# EAGLE board BlueBoard_v1 (EAGLE 6.2), part 1 of 3
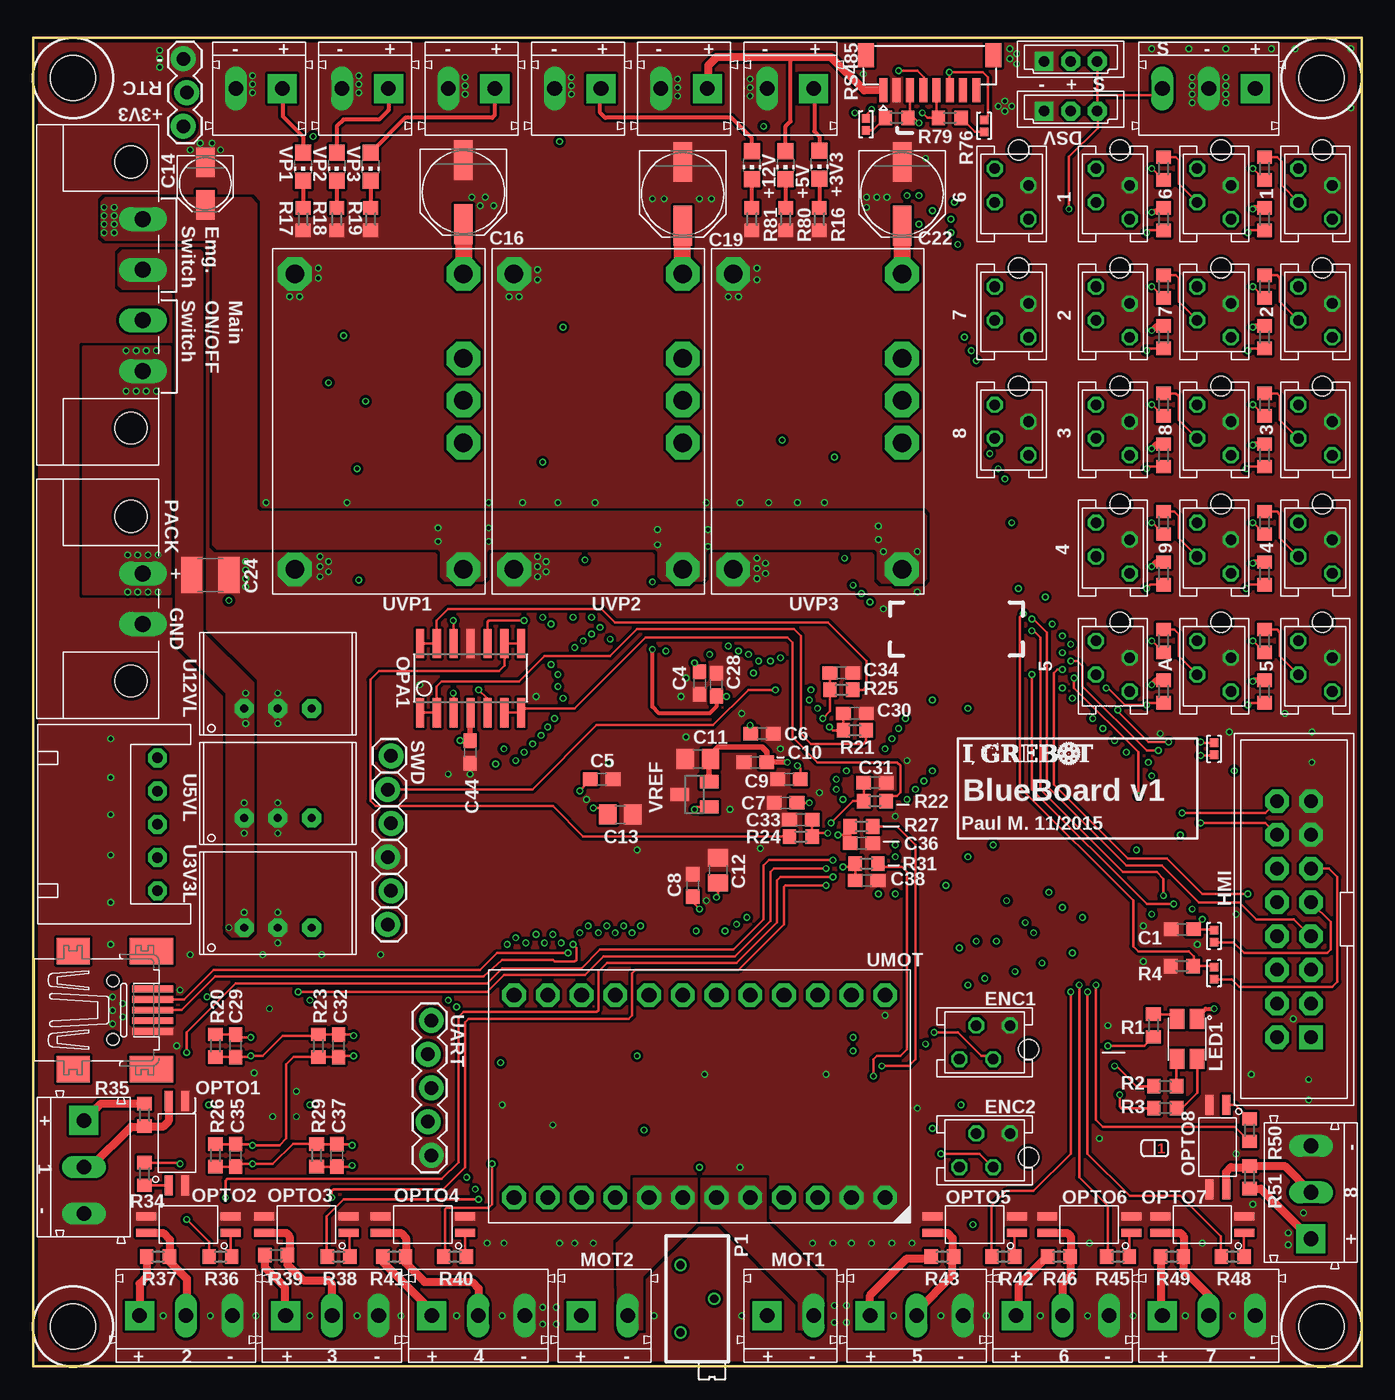
[diagram p6: board, top side]
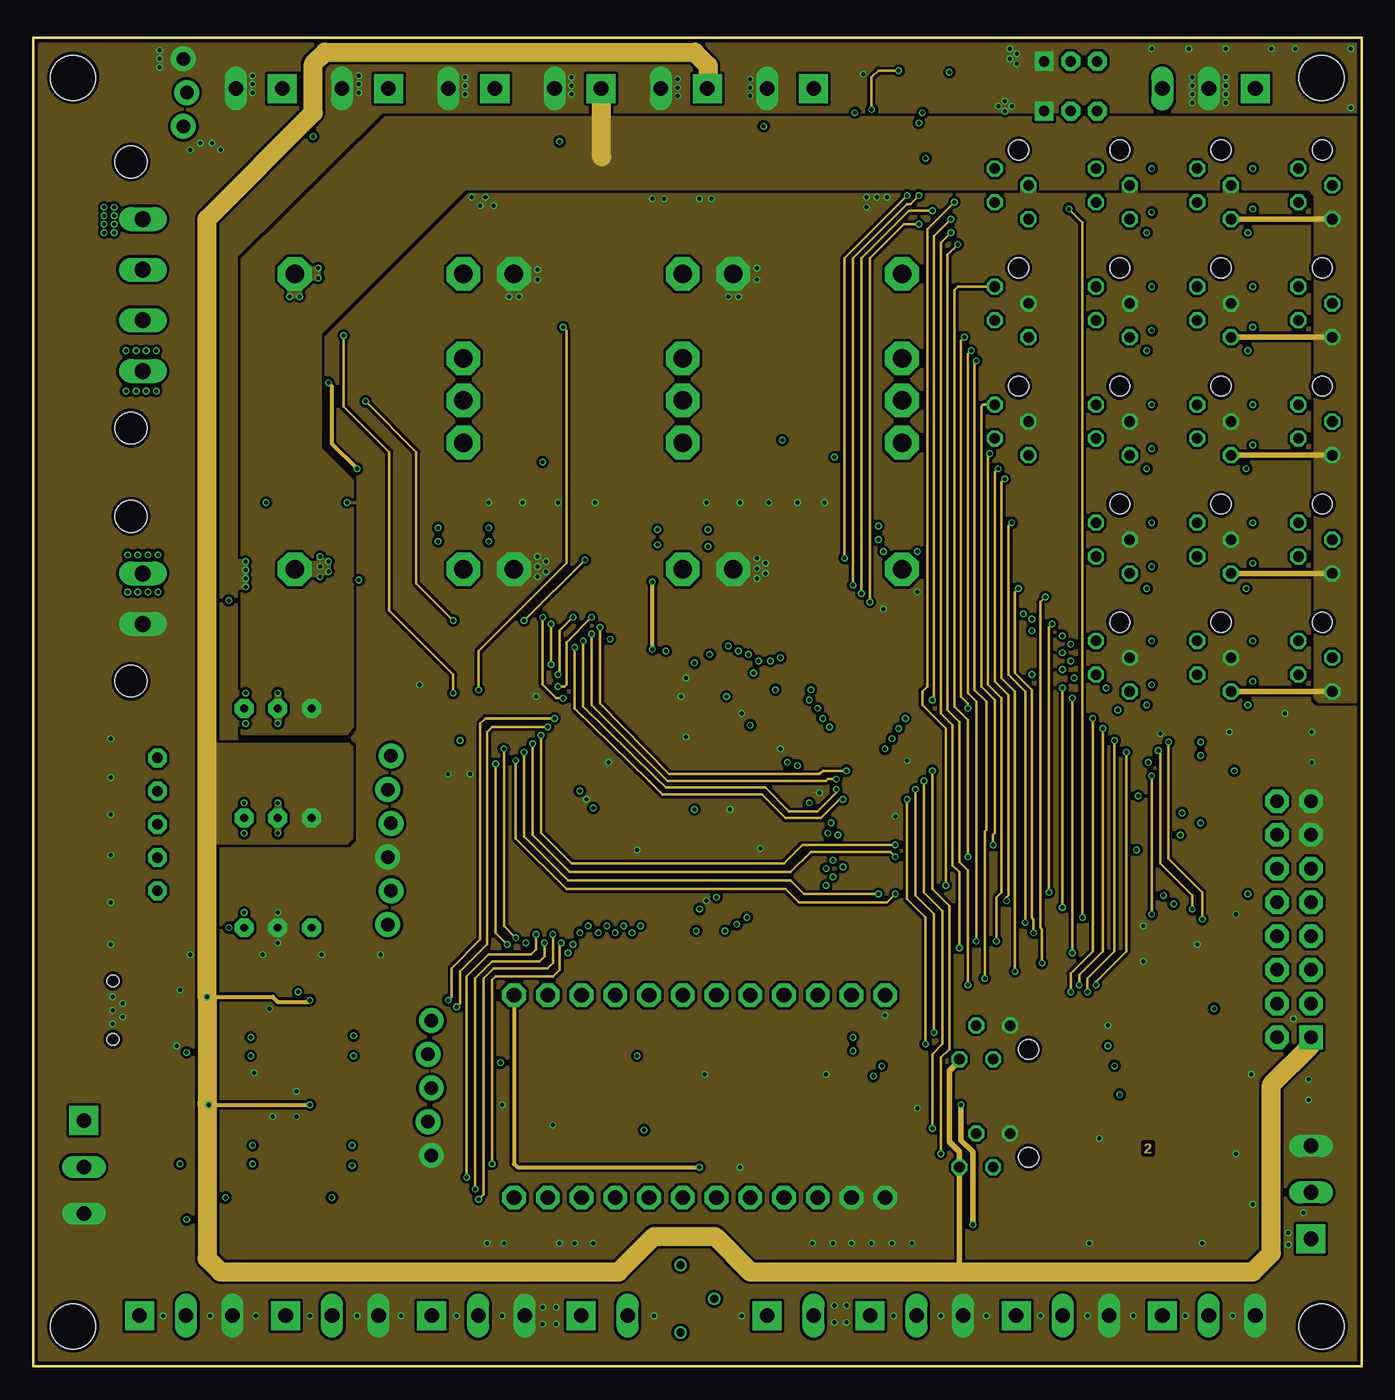
[diagram p7: board, inner layer Route2]
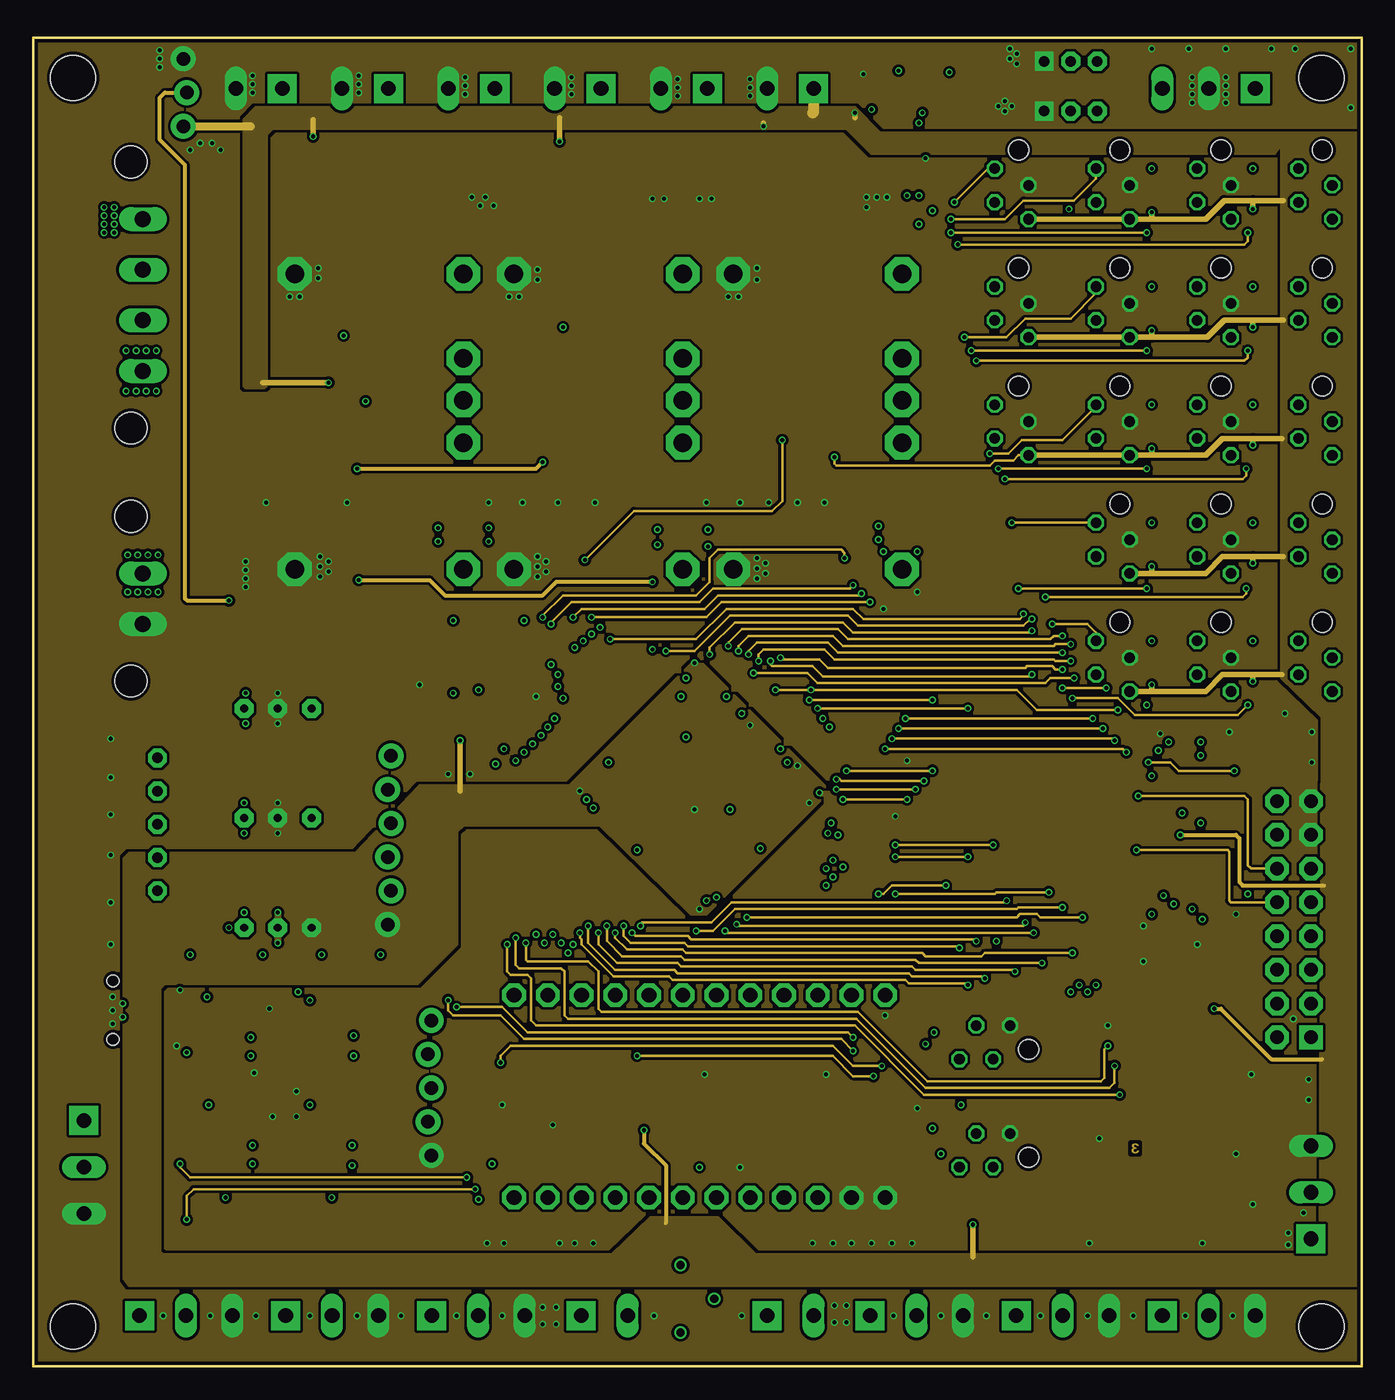
[diagram p8: board, inner layer Route15]
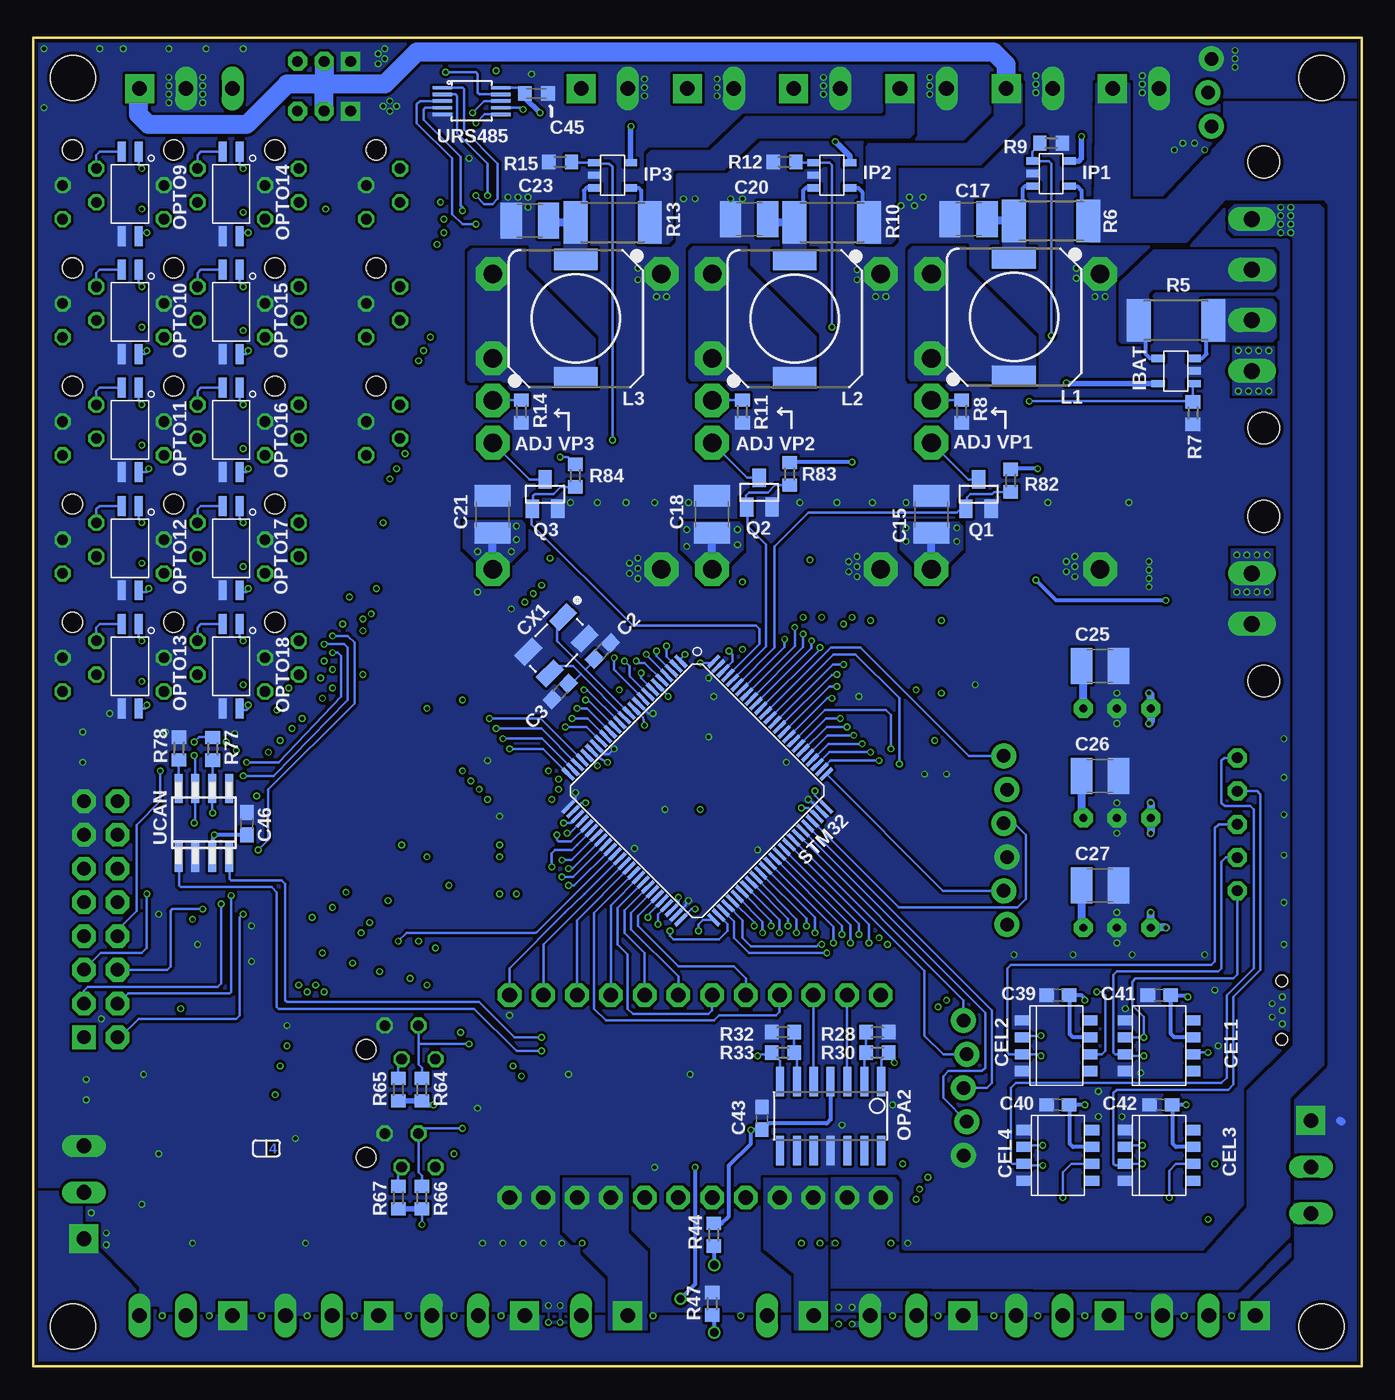
[diagram p9: board, bottom side, seen from below]

Size 100 x 100 mm. Coordinates in mm from the lower left corner, seen from the top.
Outline: 0,0 100,0 100,100 0,100 0,0
Copper layers (1*2*15*16): Top 0.035mm / dielectric 0.2mm / Route2 0.0175mm / dielectric 0.3mm / Route15 0.0175mm / dielectric 0.2mm / Bottom 0.035mm
Design rules: minimum track width 8mil, minimum drill 12mil, track to track 8mil, track to pad 8mil, pad to pad 8mil, via to via 8mil, smd to smd 0mil, copper to edge 10mil, drill to drill 8mil, minimum pad ring 6mil, minimum via ring 4mil, stop-mask expansion 4mil, vias tented up to drill 100mil, thermal gap 10mil
Holes 3.4 mm at 3,97 97,97 97,3 3,3

## Footprints (pad centres in the part's own frame; a part is rotated, then mirrored left to right if it is on the bottom)
CON_3.5_3 = drill 1.1 pad 2.184 square: 1 -3.5,0 | drill 1.1 long: 2 0,0; 3 3.5,0
CON_3.81_LR_2 = drill 1.2 long: 1 -1.905,0; 2 1.905,0 | hole 2.4: -6.205,-0.9; 6.205,-0.9
JST-XH-5S = drill 0.8 pad 1.422 octagon: 1 -5,0; 2 -2.5,0; 3 0,0; 4 2.5,0; 5 5,0
C0603 = smd 1.1 x 1: 1 -0.85,0; 2 0.85,0
C0805 = smd 1.3 x 1.5: 1 -0.95,0; 2 0.95,0
PANASONIC_B = smd 2.2 x 1.4: + 1.6,0; - -1.6,0
C3225 = smd 1.6 x 2.7: 1 -1.4,0; 2 1.4,0
PANASONIC_D = smd 3 x 1.4: + 2.4,0; - -2.4,0
C1210 = smd 1.6 x 2.7: 1 -1.4,0; 2 1.4,0
C0603K = smd 1.05 x 1.08: 1 -0.875,0; 2 0.875,0
S8 = smd 0.762 x 1.143: 1 -1.905,-2.54; 2 -0.635,-2.54; 3 0.635,-2.54; 4 1.905,-2.54; 5 1.905,2.54; 6 0.635,2.54; 7 -0.635,2.54; 8 -1.905,2.54
CRYSTAL-OSC-SMD-5X3 = smd 1.9 x 1.1: 1 -1.85,-1.15; 2 1.85,-1.15; 3 1.85,1.15; 4 -1.85,1.15
CON_2.00_MOLEX-53253_3 = drill 0.8 pad 1.422 square: 1 -2,0 | drill 0.8 pad 1.422 octagon: 2 0,0; 3 2,0
CON_1.27_4 = drill 0.8 octagon: 1 -1.905,-1.27; 2 -0.635,1.27; 3 0.635,-1.27; 4 1.905,1.27 | hole 1.5: 3.305,-0.53
CON_2X_2.54_V_16 = drill 1.02 pad 1.778 square: 1 8.89,1.27 | drill 1.02 pad 1.778 octagon: 2 8.89,-1.27; 3 6.35,1.27; 4 6.35,-1.27; 5 3.81,1.27; 6 3.81,-1.27; 7 1.27,1.27; 8 1.27,-1.27; 9 -1.27,1.27; 10 -1.27,-1.27; 11 -3.81,1.27; 12 -3.81,-1.27; 13 -6.35,1.27; 14 -6.35,-1.27; 15 -8.89,1.27; 16 -8.89,-1.27
DBV_05 = smd 0.55 x 1: 1 -0.95,-1.35; 2 0,-1.35; 3 0.95,-1.35; 4 0.95,1.35; 5 -0.95,1.35
DR1030 = smd 3.3 x 1.6: 1 0,4.45; 2 0,-4.45
PLCC4 = smd 1.1 x 1.5: 1 -0.75,-1.5; 2 -0.75,1.5; 3 0.75,1.5; 4 0.75,-1.5
CHIP-LED0805 = smd 1.2 x 1.2: A 0,-1.05; C 0,1.05
CON_3.5_2 = drill 1.1 pad 2.184 square: 1 -1.75,0 | drill 1.1 long: 2 1.75,0
SO14 = smd 0.61 x 2.21: 1 -3.81,-2.603; 2 -2.54,-2.603; 3 -1.27,-2.603; 4 0,-2.603; 5 1.27,-2.603; 6 2.54,-2.603; 7 3.81,-2.603; 8 3.81,2.603; 9 2.54,2.603; 10 1.27,2.603; 11 0,2.603; 12 -1.27,2.603; 13 -2.54,2.603; 14 -3.81,2.603
SSOP_4 = smd 1.5 x 0.6: 1 -3.175,0.635; 2 -3.175,-0.635; 3 3.175,-0.635; 4 3.175,0.635
RTRIMT93XB = drill 0.61: 1 1.27,-2.54; 2 -1.27,0; 3 1.27,2.54
SOT23 = smd 1 x 1.4: 1 -0.95,-1.1; 2 0.95,-1.1; 3 0,1.1
R0603 = smd 1 x 1.1: 1 -0.85,0; 2 0.85,0
R2512 = smd 1.8 x 3.2: 1 -2.8,0; 2 2.8,0
JST-SHR-08V = smd 0.6 x 1.8: 1 -3.5,-3.55; 2 -2.5,-3.55; 3 -1.5,-3.55; 4 -0.5,-3.55; 5 0.5,-3.55; 6 1.5,-3.55; 7 2.5,-3.55; 8 3.5,-3.55 | smd 1.2 x 1.8: M1 -4.8,-0.9; M2 4.8,-0.9
1X03_LOCK = drill 1.016 pad 1.88: 1 0,0.127; 2 2.54,-0.127; 3 5.08,0.127
SJ_2S-NOTRACE = smd 0.635 x 0.635: 1 -0.457,0; 2 0.457,0
LQFP_100 = smd 0.28 x 1.2: 1 -6,-7.75; 2 -5.5,-7.75; 3 -5,-7.75; 4 -4.5,-7.75; 5 -4,-7.75; 6 -3.5,-7.75; 7 -3,-7.75; 8 -2.5,-7.75; 9 -2,-7.75; 10 -1.5,-7.75; 11 -1,-7.75; 12 -0.5,-7.75; 13 0,-7.75; 14 0.5,-7.75; 15 1,-7.75; 16 1.5,-7.75; 17 2,-7.75; 18 2.5,-7.75; 19 3,-7.75; 20 3.5,-7.75; 21 4,-7.75; 22 4.5,-7.75; 23 5,-7.75; 24 5.5,-7.75; 25 6,-7.75; 51 6,7.75; 52 5.5,7.75; 53 5,7.75; 54 4.5,7.75; 55 4,7.75; 56 3.5,7.75; 57 3,7.75; 58 2.5,7.75; 59 2,7.75; 60 1.5,7.75; 61 1,7.75; 62 0.5,7.75; 63 0,7.75; 64 -0.5,7.75; 65 -1,7.75; 66 -1.5,7.75; 67 -2,7.75; 68 -2.5,7.75; 69 -3,7.75; 70 -3.5,7.75; 71 -4,7.75; 72 -4.5,7.75; 73 -5,7.75; 74 -5.5,7.75; 75 -6,7.75 | smd 1.2 x 0.28: 26 7.75,-6; 27 7.75,-5.5; 28 7.75,-5; 29 7.75,-4.5; 30 7.75,-4; 31 7.75,-3.5; 32 7.75,-3; 33 7.75,-2.5; 34 7.75,-2; 35 7.75,-1.5; 36 7.75,-1; 37 7.75,-0.5; 38 7.75,0; 39 7.75,0.5; 40 7.75,1; 41 7.75,1.5; 42 7.75,2; 43 7.75,2.5; 44 7.75,3; 45 7.75,3.5; 46 7.75,4; 47 7.75,4.5; 48 7.75,5; 49 7.75,5.5; 50 7.75,6; 76 -7.75,6; 77 -7.75,5.5; 78 -7.75,5; 79 -7.75,4.5; 80 -7.75,4; 81 -7.75,3.5; 82 -7.75,3; 83 -7.75,2.5; 84 -7.75,2; 85 -7.75,1.5; 86 -7.75,1; 87 -7.75,0.5; 88 -7.75,0; 89 -7.75,-0.5; 90 -7.75,-1; 91 -7.75,-1.5; 92 -7.75,-2; 93 -7.75,-2.5; 94 -7.75,-3; 95 -7.75,-3.5; 96 -7.75,-4; 97 -7.75,-4.5; 98 -7.75,-5; 99 -7.75,-5.5; 100 -7.75,-6
1X06_LOCK = drill 1.016 pad 1.88: 1 0,0; 2 2.54,-0.254; 3 5.08,0; 4 7.62,-0.254; 5 10.16,0; 6 12.7,-0.254
CON_3.81_LR_4 = drill 1.2 long: 1 -5.715,0; 2 -1.905,0; 3 1.905,0; 4 5.715,0 | hole 2.4: -10.015,-0.9; 10.015,-0.9
TSR1 = drill 0.6 pad 1.422 octagon: 1 -2.54,0; 2 0,0; 3 2.54,0
1X05_LOCK = drill 1.016 pad 1.88: 1 0,0.127; 2 2.54,-0.127; 3 5.08,0.127; 4 7.62,-0.127; 5 10.16,0.127
SO-08 = smd 0.6 x 2.2: 1 -1.905,-2.6; 2 -0.635,-2.6; 3 0.635,-2.6; 4 1.905,-2.6; 5 1.905,2.6; 6 0.635,2.6; 7 -0.635,2.6; 8 -1.905,2.6
MODULE_DRV884X_REV = drill 1.1 pad 1.778 octagon: 1 -13.97,17.145; 2 -11.43,17.145; 3 -8.89,17.145; 4 -6.35,17.145; 5 -3.81,17.145; 6 -1.27,17.145; 7 1.27,17.145; 8 3.81,17.145; 9 6.35,17.145; 10 8.89,17.145; 11 11.43,17.145; 12 13.97,17.145; 13 1.27,1.905; 14 3.81,1.905; 15 6.35,1.905; 16 8.89,1.905; 17 11.43,1.905; 18 13.97,1.905; 19 -1.27,1.905; 20 -3.81,1.905; 21 -6.35,1.905; 22 -8.89,1.905; 23 -11.43,1.905; 24 -13.97,1.905
MSOP-10 = smd 0.25 x 1.45: 1 -1,-2.2; 2 -0.5,-2.2; 3 0,-2.2; 4 0.5,-2.2; 5 1,-2.2; 6 1,2.2; 7 0.5,2.2; 8 0,2.2; 9 -0.5,2.2; 10 -1,2.2
32005-201 = smd 3.1 x 0.5: 1 3,1.6; 2 3,0.8; 3 3,0; 4 3,-0.8; 5 3,-1.6 | smd 2.5 x 2: M1 -3,-4.45; M2 -3,4.45 | smd 3.3 x 2: M3 2.9,4.45; M4 2.9,-4.45 | hole 0.9: 0,2.2; 0,-2.2
PTN78060 = drill 1.4 pad 2.54 octagon: 1 -11.113,6.35; 2 -11.113,-6.35; 3 -1.587,-6.35; 4 1.587,-6.35; 5 4.763,-6.35; 6 11.113,-6.35; 7 11.113,6.35

## Placement (x,y rotation side)
ASV1  CON_3.5_3  [CON_3.5_3]  3.81,15 270 top
ASV2  CON_3.5_3  [CON_3.5_3]  11.5,3.81 0 top
ASV3  CON_3.5_3  [CON_3.5_3]  22.5,3.81 0 top
ASV4  CON_3.5_3  [CON_3.5_3]  33.5,3.81 0 top
ASV5  CON_3.5_3  [CON_3.5_3]  66.5,3.81 0 top
ASV6  CON_3.5_3  [CON_3.5_3]  77.5,3.81 0 top
ASV7  CON_3.5_3  [CON_3.5_3]  88.5,3.81 0 top
ASV8  CON_3.5_3  [CON_3.5_3]  96.19,13.1 90 top
BAT1  MC15-GF-3.81-LR_2  [CON_3.81_LR_2]  8.26,57.78 270 top
BAT2  JST-XH-S_5  [JST-XH-5S]  9.36,40.8 90 top
C1  100nF  [C0603]  86.5,32.9 180 top
C2  18 pF  [C0603]  57.15,53.85 45 bottom
C3  18 pF  [C0603]  60.33,50.8 225 bottom
C4  100nF  [C0603]  50.16,51.44 270 top
C5  100nF  [C0603]  42.8,44.2 0 top
C6  100nF  [C0603]  54.86,47.62 0 top
C7  100nF  [C0603]  56.64,42.42 180 top
C8  100nF  [C0603]  49.66,36.2 90 top
C9  10nF  [C0603]  56.9,44.2 180 top
C10  10nF  [C0603]  54.36,45.47 180 top
C11  1uF  [C0805]  50.04,45.72 180 top
C12  2.2uF  [C0805]  51.56,37.34 90 top
C13  2.2uF  [C0805]  44.2,41.53 0 top
C14  22uF  [PANASONIC_B]  12.95,89.03 270 top
C15  22uF  [C3225]  32.38,64.14 90 bottom
C16  220uF  [PANASONIC_D]  32.38,88.39 270 top
C17  2.2uF  [C3225]  29.59,86.36 180 bottom
C18  22uF  [C3225]  48.9,64.14 90 bottom
C19  220uF  [PANASONIC_D]  48.9,88.27 270 top
C20  2.2uF  [C3225]  46.1,86.36 180 bottom
C21  22uF  [C3225]  65.41,64.14 90 bottom
C22  220uF  [PANASONIC_D]  65.41,88.27 270 top
C23  2.2uF  [C3225]  62.61,86.23 180 bottom
C24  22uF  [C3225]  13.34,59.56 0 top
C25  22uF  [C1210]  19.68,52.7 0 bottom
C26  22uF  [C1210]  19.68,44.45 0 bottom
C27  22uF  [C1210]  19.68,36.2 0 bottom
C28  100nF  [C0603]  51.44,51.31 90 top
C29  100nF  [C0603]  15.24,24.13 270 top
C30  3.3nF  [C0603]  61.85,49.15 0 top
C31  3.3nF  [C0603]  63.37,43.94 0 top
C32  100nF  [C0603]  22.99,24.13 270 top
C33  3.3nF  [C0603]  57.78,41.15 180 top
C34  3.3nF  [C0603]  60.83,52.2 0 top
C35  100nF  [C0603]  15.24,15.88 270 top
C36  3.3nF  [C0603]  62.36,39.37 0 top
C37  100nF  [C0603]  22.86,15.88 270 top
C38  3.3nF  [C0603]  62.74,36.58 0 top
C39  220nF  [C0603]  22.86,27.94 180 bottom
C40  220nF  [C0603]  22.86,19.68 180 bottom
C41  220nF  [C0603]  15.24,27.94 180 bottom
C42  220nF  [C0603]  15.11,19.68 180 bottom
C43  100nF  [C0603]  45.13,18.66 90 bottom
C44  100nF  [C0603]  32.89,46.24 270 top
C45  100nF  [C0603K]  62.12,95.81 0 bottom
C46  100nF  [C0603]  83.9,40.85 90 bottom
CEL1  LT1990  [S8]  15.24,24.13 270 bottom
CEL2  LT1990  [S8]  22.99,24.13 270 bottom
CEL3  LT1990  [S8]  15.24,15.88 270 bottom
CEL4  LT1990  [S8]  22.86,15.88 270 bottom
CX1  XTAL_5X3  [CRYSTAL-OSC-SMD-5X3]  60.61,54.28 225 bottom
DSV1  CON_2.00_MOLEX-53253_3  [CON_2.00_MOLEX-53253_3]  78.1,98.24 0 top
DSV2  CON_2.00_MOLEX-53253_3  [CON_2.00_MOLEX-53253_3]  78.1,94.5 0 top
DSV3  CON_3.5_3  [CON_3.5_3]  88.5,96.19 180 top
ENC1  CON_1.27_4  [CON_1.27_4]  71.63,24.38 0 top
ENC2  CON_1.27_4  [CON_1.27_4]  71.63,16.26 0 top
END1  CON_1.27_4  [CON_1.27_4]  81.28,88.27 90 top
END2  CON_1.27_4  [CON_1.27_4]  81.28,79.38 90 top
END3  CON_1.27_4  [CON_1.27_4]  81.28,70.48 90 top
END4  CON_1.27_4  [CON_1.27_4]  81.28,61.59 90 top
END5  CON_1.27_4  [CON_1.27_4]  81.28,52.7 90 top
END6  CON_1.27_4  [CON_1.27_4]  73.66,88.27 90 top
END7  CON_1.27_4  [CON_1.27_4]  73.66,79.38 90 top
END8  CON_1.27_4  [CON_1.27_4]  73.66,70.48 90 top
HMI  HE10_V_16  [CON_2X_2.54_V_16]  94.92,33.66 270 top
IBAT  INA138  [DBV_05]  13.97,74.93 90 bottom
IND1  CON_1.27_4  [CON_1.27_4]  96.52,88.27 90 top
IND2  CON_1.27_4  [CON_1.27_4]  96.52,79.38 90 top
IND3  CON_1.27_4  [CON_1.27_4]  96.52,70.48 90 top
IND4  CON_1.27_4  [CON_1.27_4]  96.52,61.59 90 top
IND5  CON_1.27_4  [CON_1.27_4]  96.52,52.7 90 top
IND6  CON_1.27_4  [CON_1.27_4]  88.9,88.27 90 top
IND7  CON_1.27_4  [CON_1.27_4]  88.9,79.38 90 top
IND8  CON_1.27_4  [CON_1.27_4]  88.9,70.48 90 top
IND9  CON_1.27_4  [CON_1.27_4]  88.9,61.59 90 top
IND10  CON_1.27_4  [CON_1.27_4]  88.9,52.7 90 top
IP1  INA138  [DBV_05]  23.37,89.79 270 bottom
IP2  INA138  [DBV_05]  39.88,89.66 270 bottom
IP3  INA138  [DBV_05]  56.39,89.66 270 bottom
L1  2.8uH  [DR1030]  26.16,78.99 180 bottom
L2  2.8uH  [DR1030]  42.67,78.87 180 bottom
L3  2.8uH  [DR1030]  59.15,78.88 180 bottom
LED1  ASMB-MTB0-0A3A2  [PLCC4]  86.87,24.64 180 top
LED4  [CHIP-LED0805]  59.18,90.45 180 top
LED5  [CHIP-LED0805]  20.32,90.31 180 top
LED6  [CHIP-LED0805]  22.86,90.32 180 top
LED7  [CHIP-LED0805]  25.4,90.32 180 top
LED8  [CHIP-LED0805]  56.64,90.42 180 top
LED9  [CHIP-LED0805]  54.1,90.42 180 top
LOGO_IGREBOT  LOGO_IGREBOT12X2MM  [IGREBOT_12X2MM]  69.98,45.47 0 top
LOGO_LAYERS  LAYERS_CHECK4_LAYERS  [LAYERS_CHECK_4]  83.44,17.02 180 top
MOT1  CON_3.5_2  [CON_3.5_2]  57,3.81 0 top
MOT2  CON_3.5_2  [CON_3.5_2]  43,3.81 0 top
OPA1  OPA4340U  [SO14]  32.93,51.8 0 top
OPA2  OPA4340U  [SO14]  39.97,18.84 180 bottom
OPTO1  EL3H7-G  [SSOP_4]  10.82,16.79 90 top
OPTO2  EL3H7-G  [SSOP_4]  11.68,10.67 180 top
OPTO3  EL3H7-G  [SSOP_4]  20.57,10.67 180 top
OPTO4  EL3H7-G  [SSOP_4]  29.34,10.67 180 top
OPTO5  EL3H7-G  [SSOP_4]  70.87,10.67 180 top
OPTO6  EL3H7-G  [SSOP_4]  79.5,10.67 180 top
OPTO7  EL3H7-G  [SSOP_4]  88.01,10.67 180 top
OPTO8  EL3H7-G  [SSOP_4]  89.17,16.51 270 top
OPTO9  EL3H4-G  [SSOP_4]  92.71,88.27 270 bottom
OPTO10  EL3H4-G  [SSOP_4]  92.71,79.38 270 bottom
OPTO11  EL3H4-G  [SSOP_4]  92.71,70.48 270 bottom
OPTO12  EL3H4-G  [SSOP_4]  92.71,61.59 270 bottom
OPTO13  EL3H4-G  [SSOP_4]  92.71,52.7 270 bottom
OPTO14  EL3H4-G  [SSOP_4]  85.09,88.27 270 bottom
OPTO15  EL3H4-G  [SSOP_4]  85.09,79.38 270 bottom
OPTO16  EL3H4-G  [SSOP_4]  85.09,70.48 270 bottom
OPTO17  EL3H4-G  [SSOP_4]  85.09,61.59 270 bottom
OPTO18  EL3H4-G  [SSOP_4]  85.09,52.7 270 bottom
P1  50k  [RTRIMT93XB]  50,5.08 180 top
Q1  BSS138  [SOT23]  28.83,65.66 0 bottom
Q2  BSS138  [SOT23]  45.34,65.79 0 bottom
Q3  BSS138  [SOT23]  61.47,65.66 0 bottom
R1  270  [R0603]  84.33,25.65 90 top
R2  47  [R0603]  85.22,21.08 0 top
R3  47  [R0603]  85.22,19.43 0 top
R4  47k  [R0603]  86.47,30.12 0 top
R5  R005  [R2512]  13.97,78.74 180 bottom
R6  R01  [R2512]  23.37,86.23 0 bottom
R7  300k  [R0603]  12.7,71.75 90 bottom
R8  21k  [R0603]  30.1,71.88 90 bottom
R9  510k  [R0603]  23.37,92.08 180 bottom
R10  R01  [R2512]  39.88,86.11 0 bottom
R11  7.5k  [R0603]  46.61,71.88 90 bottom
R12  510k  [R0603]  43.43,90.68 0 bottom
R13  R01  [R2512]  56.39,86.11 0 bottom
R14  383k  [R0603]  63.25,71.88 90 bottom
R15  510k  [R0603]  60.33,90.68 0 bottom
R16  270  [R0603]  59.18,86.36 270 top
R17  680  [R0603]  20.32,86.36 270 top
R18  1k  [R0603]  22.86,86.36 270 top
R19  2k  [R0603]  25.4,86.36 270 top
R20  47k  [R0603]  13.72,24.13 90 top
R21  470  [R0603]  61.85,47.88 180 top
R22  470  [R0603]  63.37,42.55 180 top
R23  47k  [R0603]  21.46,24.13 90 top
R24  470  [R0603]  57.78,39.88 0 top
R25  470  [R0603]  60.83,50.93 180 top
R26  47k  [R0603]  13.72,15.88 90 top
R27  470  [R0603]  62.36,40.64 180 top
R28  10k  [R0603]  36.45,25.15 180 bottom
R29  47k  [R0603]  21.34,15.88 90 top
R30  33k  [R0603]  36.45,23.62 0 bottom
R31  470  [R0603]  62.74,37.85 180 top
R32  10k  [R0603]  43.56,25.15 0 bottom
R33  33k  [R0603]  43.56,23.62 180 bottom
R34  330  [R0603]  8.38,14.48 270 top
R35  330  [R0603]  8.38,18.92 90 top
R36  330  [R0603]  14.1,8.26 0 top
R37  330  [R0603]  9.4,8.26 180 top
R38  330  [R0603]  22.99,8.26 0 top
R39  330  [R0603]  18.29,8.38 180 top
R40  330  [R0603]  31.75,8.26 0 top
R41  330  [R0603]  27.18,8.26 180 top
R42  330  [R0603]  73.03,8.26 0 top
R43  330  [R0603]  68.45,8.26 180 top
R44  33k  [R0603]  48.77,9.91 90 bottom
R45  330  [R0603]  81.66,8.26 0 top
R46  330  [R0603]  77.22,8.26 180 top
R47  21k  [R0603]  48.9,4.7 270 bottom
R48  330  [R0603]  90.3,8.26 0 top
R49  330  [R0603]  85.72,8.26 180 top
R50  330  [R0603]  91.57,17.78 90 top
R51  330  [R0603]  91.57,14.22 270 top
R52  1k  [R0603]  92.71,90.17 270 top
R53  330  [R0603]  92.71,86.36 90 top
R54  1k  [R0603]  92.71,81.28 270 top
R55  330  [R0603]  92.71,77.47 90 top
R56  1k  [R0603]  92.71,72.39 270 top
R57  330  [R0603]  92.71,68.58 90 top
R58  1k  [R0603]  92.71,63.5 270 top
R59  330  [R0603]  92.71,59.69 90 top
R60  1k  [R0603]  92.71,54.61 270 top
R61  330  [R0603]  92.71,50.8 90 top
R62  1k  [R0603]  85.09,90.17 270 top
R63  330  [R0603]  85.09,86.36 90 top
R64  10k  [R0603]  70.74,20.83 270 bottom
R65  10k  [R0603]  72.52,20.83 270 bottom
R66  10k  [R0603]  70.74,12.7 270 bottom
R67  10k  [R0603]  72.52,12.7 270 bottom
R68  1k  [R0603]  85.09,81.28 270 top
R69  330  [R0603]  85.09,77.47 90 top
R70  1k  [R0603]  85.09,72.39 270 top
R71  330  [R0603]  85.09,68.58 90 top
R72  1k  [R0603]  85.09,63.5 270 top
R73  330  [R0603]  85.09,59.69 90 top
R74  1k  [R0603]  85.09,54.61 270 top
R75  330  [R0603]  85.09,50.8 90 top
R76  120  [R0603]  69,93.98 0 top
R77  120  [R0603]  86.49,46.48 270 bottom
R78  10k  [R0603]  89.02,46.5 270 bottom
R79  120  [R0603]  65,93.98 180 top
R80  470  [R0603]  56.64,86.36 270 top
R81  2.2k  [R0603]  54.1,86.36 270 top
R82  47k  [R0603]  26.42,66.67 90 bottom
R83  47k  [R0603]  43.05,67.18 90 bottom
R84  47k  [R0603]  59.18,67.06 90 bottom
RS485  JST-SHR-8V  [JST-SHR-08V]  67.5,99.6 0 top
RTC  [1X03_LOCK]  11.43,93.34 90 top
SJ1  SOLDERJUMPERNC2  [SJ_2S-NOTRACE]  88.9,32.38 270 top
SJ2  SOLDERJUMPERNC2  [SJ_2S-NOTRACE]  88.9,29.59 270 top
SJ3  SOLDERJUMPERNC2  [SJ_2S-NOTRACE]  71.58,93.38 270 top
SJ4  SOLDERJUMPERNC2  [SJ_2S-NOTRACE]  88.9,46.48 90 top
SJ5  SOLDERJUMPERNC2  [SJ_2S-NOTRACE]  62.69,93.5 270 top
STM32  STM32F746VG  [LQFP_100]  50.01,43.34 225 bottom
SWD  [1X06_LOCK]  26.68,33.26 90 top
SWITCHS  MC15-GF-3.81-LR_4  [CON_3.81_LR_4]  8.26,80.64 270 top
U3V3L  TSR_1-2433  [TSR1]  18.41,33.02 0 top
U5VL  TSR_1-2450  [TSR1]  18.41,41.27 0 top
U12VL  TSR_1-24120  [TSR1]  18.41,49.53 0 top
UART  [1X05_LOCK]  29.84,26.04 270 top
UCAN  SN65HVD230D  [SO-08]  87.16,40.91 0 bottom
UMOT  MODULE_DRV8843REV  [MODULE_DRV884X_REV]  50.16,29.84 180 top
URS485  SN65HVD1476-DGS  [MSOP-10]  67,95.25 270 bottom
USB  MINI-USB-32005-201  [32005-201]  6,26.82 0 top
UVP1  PTN78060W  [PTN78060]  26.04,71.12 90 top
UVP2  PTN78060W  [PTN78060]  42.55,71.12 90 top
UVP3  PTN78060H  [PTN78060]  59.05,71.12 90 top
VCC1  CON_3.5_2  [CON_3.5_2]  41,96.19 180 top
VCC2  CON_3.5_2  [CON_3.5_2]  49,96.19 180 top
VCC3  CON_3.5_2  [CON_3.5_2]  57,96.19 180 top
VP1  CON_3.5_2  [CON_3.5_2]  17,96.19 180 top
VP2  CON_3.5_2  [CON_3.5_2]  25,96.19 180 top
VP3  CON_3.5_2  [CON_3.5_2]  33,96.19 180 top
VREF  REF3030  [SOT23]  49.78,43.05 90 top